# EAGLE design Qwiic_AS3935_Lightning_Detector (EAGLE 9.2.1)
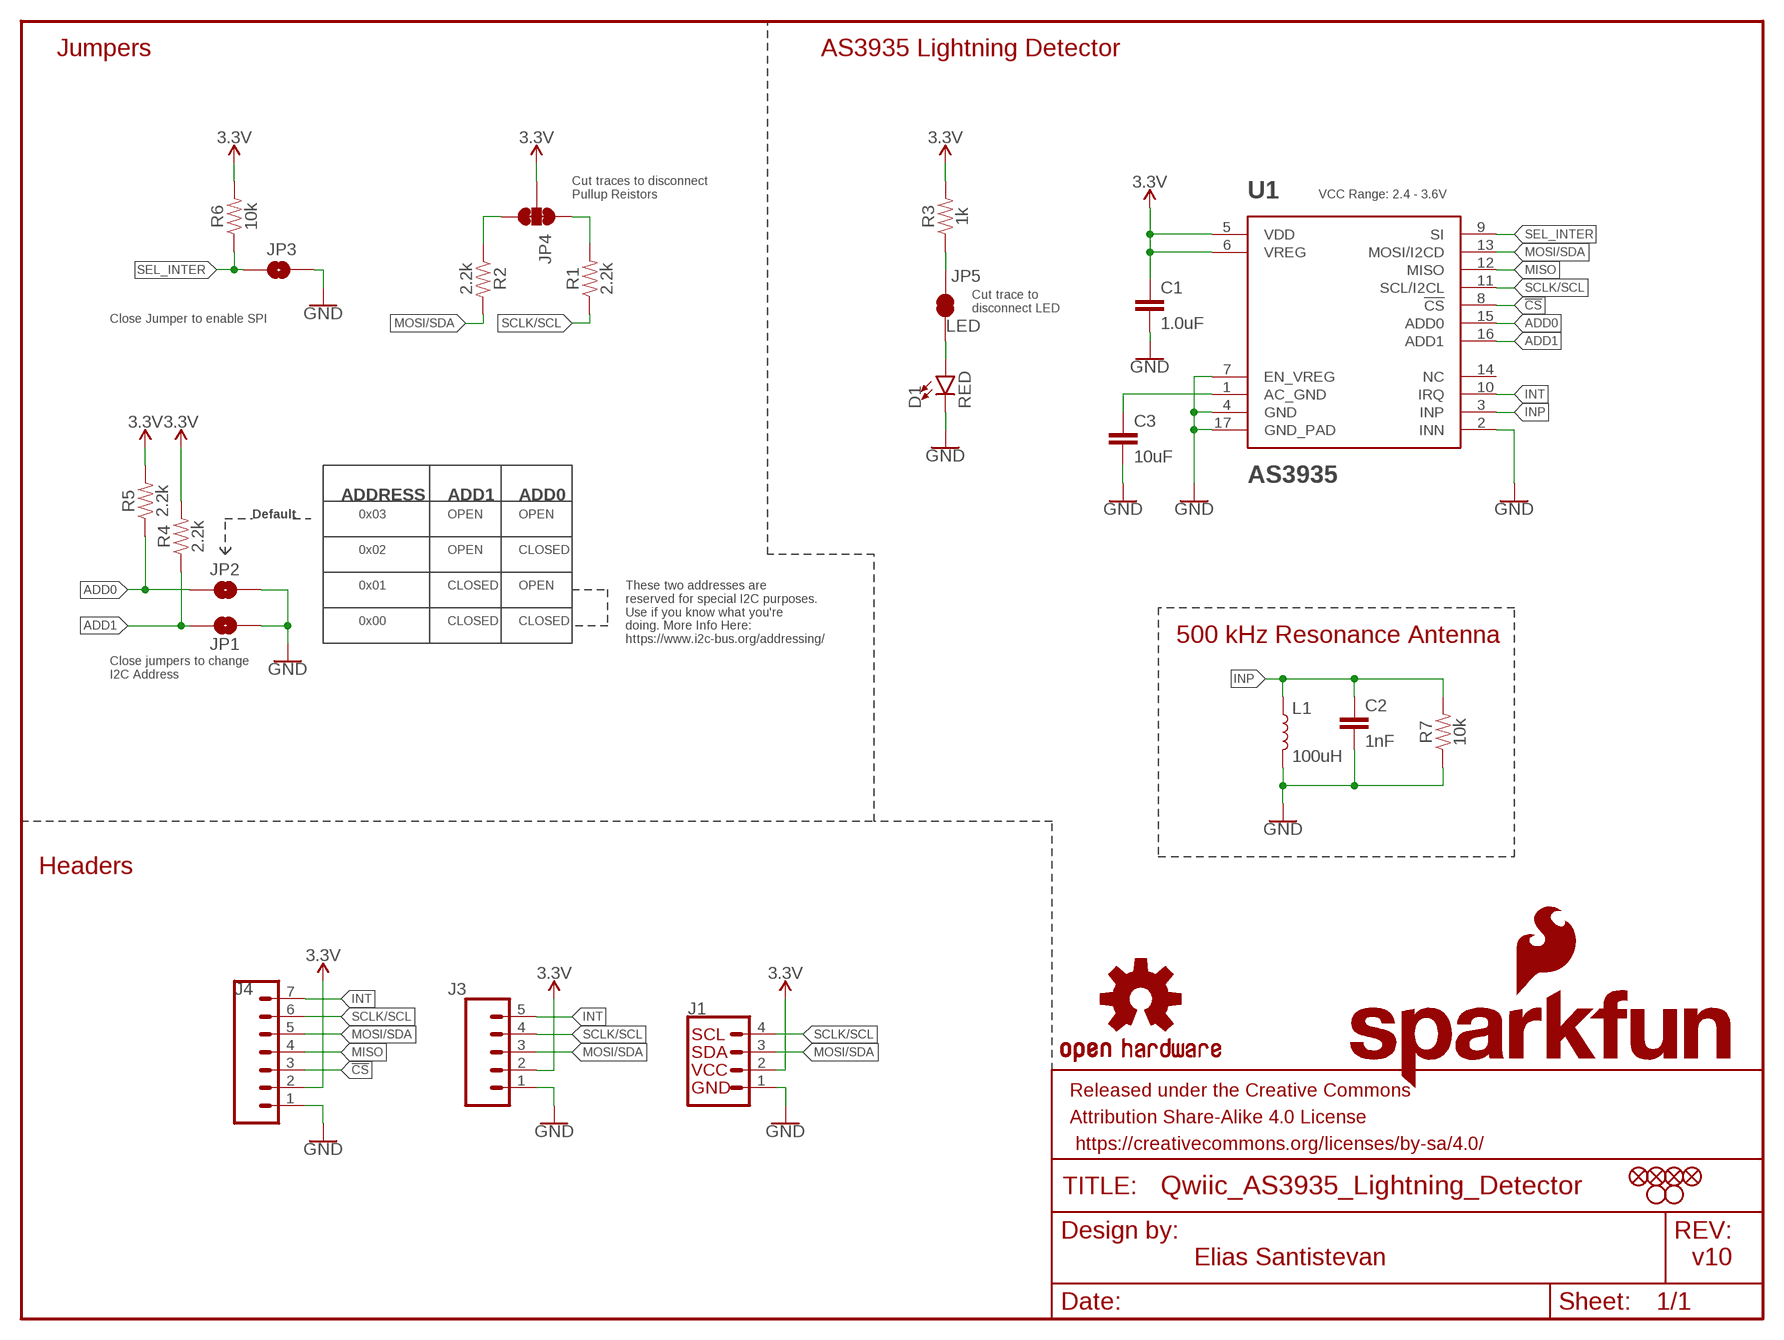
[diagram p0: schematic, sheet 1]

## Parts
C1  1.0uF  1.0UF-0603-16V-10%  [0603]
C2  1nF  1.0NF/1000PF-0603-50V-10%  [0603]
C3  10uF  10UF-0603-6.3V-20%  [0603]
D1  RED  LED-RED0603  [LED-0603]
FD1  FIDUCIAL1X2  [FIDUCIAL-1X2]
FD2  FIDUCIAL1X2  [FIDUCIAL-1X2]
FD3  FIDUCIAL1X2  [FIDUCIAL-1X2]
FD4  FIDUCIAL1X2  [FIDUCIAL-1X2]
FRAME1  FRAME-LETTER  [CREATIVE_COMMONS]
H1  STAND-OFFTIGHT  [STAND-OFF-TIGHT]
H2  STAND-OFFTIGHT  [STAND-OFF-TIGHT]
J1  QWIIC_CONNECTORJS-1MM  [JST04_1MM_RA]
J3  CONN_05NO_SILK  [1X05_NO_SILK]
J4  CONN_07NO_SILK  [1X07_NO_SILK]
JP1  JUMPER-SMT_2_NO_SILK  [SMT-JUMPER_2_NO_SILK]
JP2  JUMPER-SMT_2_NO_SILK  [SMT-JUMPER_2_NO_SILK]
JP3  JUMPER-SMT_2_NO_SILK  [SMT-JUMPER_2_NO_SILK]
JP4  JUMPER-SMT_3_2-NC_TRACE_SILK  [SMT-JUMPER_3_2-NC_TRACE_SILK]
JP5  LED  JUMPER-SMT_2_NC_TRACE_SILK  [SMT-JUMPER_2_NC_TRACE_SILK]
L1  100uH  MA5532-AE  [MA5532-AE]
LOGO1  OSHW-LOGOS  [OSHW-LOGO-S]
LOGO2  SFE_LOGO_NAME.1_INCH  [SFE_LOGO_NAME_.1]
LOGO3  SFE_LOGO_FLAME.1_INCH  [SFE_LOGO_FLAME_.1]
R1  2.2k  2.2KOHM-0603-1/10W-1%  [0603]
R2  2.2k  2.2KOHM-0603-1/10W-1%  [0603]
R3  1k  1KOHM-0603-1/10W-1%  [0603]
R4  2.2k  2.2KOHM-0603-1/10W-1%  [0603]
R5  2.2k  2.2KOHM-0603-1/10W-1%  [0603]
R6  10k  10KOHM-0603-1/10W-1%  [0603]
R7  10k  10KOHM-0603-1/10W-1%  [0603]
U1  AS3935  AS3935QFN  [16LD_MLPQ]

## Nets
3.3V: C1.1 J1.2 J3.2 J4.2 JP4.2 R3.2 R4.2 R5.2 R6.2 U1.5(VDD) U1.6(VREG)
!CS: J4.3 U1.8(!CS)
ADD0: JP2.1 R5.1 U1.15(ADD0)
ADD1: JP1.1 R4.1 U1.16(ADD1)
GND: C1.2 C2.2 C3.2 D1.C J1.1 J3.1 J4.1 JP1.2 JP2.2 JP3.2 L1.2 R7.1 U1.2(INN) U1.4(GND) U1.7(EN_VREG) U1.17(GND_PAD)
INP: C2.1 L1.1 R7.2 U1.3(INP)
INT: J3.5 J4.7 U1.10(IRQ)
MISO: J4.4 U1.12(MISO)
MOSI/SDA: J1.3 J3.3 J4.5 R2.2 U1.13(MOSI/I2CD)
N$1: JP5.2 R3.1
N$2: C3.1 U1.1(AC_GND)
N$3: JP4.1 R1.2
N$4: JP4.3 R2.1
N$5: D1.A JP5.1
SCLK/SCL: J1.4 J3.4 J4.6 R1.1 U1.11(SCL/I2CL)
SEL_INTER: JP3.1 R6.1 U1.9(SI)
Unconnected: U1.14(NC)

## Notes on the sheet
- Jumpers | AS3935 Lightning Detector
- Cut traces to disconnect
  Pullup Reistors
- VCC Range: 2.4 - 3.6V
- Cut trace to 
  disconnect LED
- Close Jumper to enable SPI
- ADDRESS | ADD1 | ADD0
- Default | 0x03 | OPEN | OPEN
- 0x02 | OPEN | CLOSED
- 0x01 | CLOSED | OPEN
- 0x00 | CLOSED | CLOSED
- These two addresses are
  reserved for special I2C purposes. 
  Use if you know what you're 
  doing. More Info Here:
  https://www.i2c-bus.org/addressing/
- 500 kHz Resonance Antenna
- Close jumpers to change 
  I2C Address
- Headers
- Elias Santistevan | v10

## Library data of the parts
C1 = SparkFun-Capacitors:1.0UF: 1µF ceramic capacitors A capacitor is a passive two-terminal electrical component used to store electrical energy temporarily in an electric field.; PROD_ID: CAP-00868
C2 = SparkFun-Capacitors:1.0NF/1000PF: 1nF/1,000pF ceramic capacitors A capacitor is a passive two-terminal electrical component used to store electrical energy temporarily in an electric field.; PROD_ID: CAP-07886
C3 = SparkFun-Capacitors:10UF: 10.0µF ceramic capacitors A capacitor is a passive two-terminal electrical component used to store electrical energy temporarily in an electric field.; PROD_ID: CAP-11015
D1 = SparkFun-LED:LED-RED: Red SMD LED Used in manufacturing of most products at SparkFun Packages: 0603 - SMD 0603 package [Product Link] <http://docs.avagotech.com/docs/AV02-0551EN> 0603 SMART - SMD 0603 SMART package ( more efficient and expensive)[Product Link] <http://www.osram-os.com/Graphics/XPic2/00077099_0.pdf> 1206 - SMD1206 package [Product Link] <https://www.sparkfun.com/datasheets/DevTools/LilyPad/Q150OVS4.pdff> SparkFun Products: Pro Mini 328 -5V <https://www.sparkfun.com/products/821> RedBoard <https://www.sparkfun.com/products/12757> IOIO-OTG <https://www.sparkfun.com/products/13613>; PROD_ID: DIO-00819
FD1-FD4 = SparkFun-Aesthetics:FIDUCIAL: Fiducial Alignment Points Point-of-reference for pick-and-place machines and other optical instruments.
FRAME1 = SparkFun-Aesthetics:FRAME-LETTER: Schematic Frame - Letter Standard 8.5x11 US Letter frame
H1 H2 = SparkFun-Hardware:STAND-OFF: Stand Off Drill holes for mechanically mounting via screws, standoffs, etc. Note: Use the keepout ring to avoid running the screw head into surrounding components. Variant Overviews STAND-OFF - Mechanical footprint for a #4 phillips button head screw. STAND-OFF-TIGHT - Mechanical footprint for a #4 phillips button head screw, Example SparkFun Products Screw - Phillips Head (1/4", 4-40, 10 pack) <https://www.sparkfun.com/products/10453> (PRT-10453) Screw - Phillips Head (1/2", 4-40, 10 pack) <https://www.sparkfun.com/products/10452> (PRT-10452) Screw - Phillips Head (3/4", 4-40, 10 pack) <https://www.sparkfun.com/products/10451> (PRT-10451) Screw - Phillips Head (1", 4-40, 10 pack) <https://www.sparkfun.com/products/10450> (PRT-10450)
J1 = SparkFun-Connectors:QWIIC_CONNECTOR: SparkFun I2C Standard Qwiic Connector An SMD 1mm pitch JST connector makes it easy and quick (get it? Qwiic?) to connect I2C devices to each other. The Qwiic system <http://www.sparkfun.com/qwiic> enables fast and solderless connection between popular platforms and various sensors and actuators. We carry 200mm <https://www.sparkfun.com/products/14204>, 100mm <https://www.sparkfun.com/products/14205>, 50mm <https://www.sparkfun.com/products/14206>, and breadboard friendly <https://www.sparkfun.com/products/14207> Qwiic cables. We also offer 10 pcs strips <https://www.sparkfun.com/products/14323> the SMD connectors.; PROD_ID: CONN-13694
J3 = SparkFun-Connectors:CONN_05: Multi connection point. Often used as Generic Header-pin footprint for 0.1 inch spaced/style header connections On any of the 0.1 inch spaced packages, you can populate with these: Break Away Headers - Straight <https://www.sparkfun.com/products/116> (PRT-00116) Break Away Male Headers - Right Angle <https://www.sparkfun.com/products/553> (PRT-00553) Female Headers <https://www.sparkfun.com/products/115> (PRT-00115) Break Away Headers - Machine Pin <https://www.sparkfun.com/products/117> (PRT-00117) Break Away Female Headers - Swiss Machine Pin <https://www.sparkfun.com/products/743> (PRT-00743) For SCREWTERMINALS and SPRING TERMINALS visit here: Screw Terimnals on SparkFun.com <https://www.sparkfun.com/search/results?term=Screw+Terminals> (5mm/3.5mm/2.54mm spacing) This device is also useful as a general connection point to wire up your design to another part of your project. Our various solder wires solder well into these plated through hole pads. Hook-Up Wire - Assortment (Stranded, 22 AWG) <https://www.sparkfun.com/products/11375> (PRT-11375) Hook-Up Wire - Assortment (Solid Core, 22 AWG) <https://www.sparkfun.com/products/11367> (PRT-11367) View the entire wire category on our website here <https://www.sparkfun.com/categories/141> Special notes: Molex polarized connector foot print use with SKU : PRT-08231 with associated crimp pins and housings. 1MM SMD Version SKU: PRT-10208
J4 = SparkFun-Connectors:CONN_07: Multi connection point. Often used as Generic Header-pin footprint for 0.1 inch spaced/style header connections On any of the 0.1 inch spaced packages, you can populate with these: Break Away Headers - Straight <https://www.sparkfun.com/products/116> (PRT-00116) Break Away Male Headers - Right Angle <https://www.sparkfun.com/products/553> (PRT-00553) Female Headers <https://www.sparkfun.com/products/115> (PRT-00115) Break Away Headers - Machine Pin <https://www.sparkfun.com/products/117> (PRT-00117) Break Away Female Headers - Swiss Machine Pin <https://www.sparkfun.com/products/743> (PRT-00743) For SCREWTERMINALS and SPRING TERMINALS visit here: Screw Terimnals on SparkFun.com <https://www.sparkfun.com/search/results?term=Screw+Terminals> (5mm/3.5mm/2.54mm spacing) This device is also useful as a general connection point to wire up your design to another part of your project. Our various solder wires solder well into these plated through hole pads. Hook-Up Wire - Assortment (Stranded, 22 AWG) <https://www.sparkfun.com/products/11375> (PRT-11375) Hook-Up Wire - Assortment (Solid Core, 22 AWG) <https://www.sparkfun.com/products/11367> (PRT-11367) View the entire wire category on our website here <https://www.sparkfun.com/categories/141> Special notes: Molex polarized connector foot print use with SKU : PRT-08231 with associated crimp pins and housings. 1MM SMD Version SKU: PRT-10208 NOTES ON THE VARIANTS LOCK and LOCK_LONGPADS... This footprint was designed to help hold the alignment of a through-hole component (i.e. 6-pin header) while soldering it into place. You may notice that each hole has been shifted either up or down by 0.005 of an inch from it's more standard position (which is a perfectly straight line). This slight alteration caused the pins (the squares in the middle) to touch the edges of the holes. Because they are alternating, it causes a "brace" to hold the component in place. 0.005 has proven to be the perfect amount of "off-center" position when using our standard breakaway headers. Although looks a little odd when you look at the bare footprint, once you have a header in there, the alteration is very hard to notice. Also,if you push a header all the way into place, it is covered up entirely on the bottom side.
JP1-JP3 = SparkFun-Jumpers:JUMPER-SMT_2_NO: Normally open jumper This jumper has two pads in close proximity to each other. Apply solder to close the connection. Round pads are easier to solder for beginners, but are a lot larger. SparkFun Product that uses the round pads: SparkFun EL Sequencer <https://www.sparkfun.com/products/12781>
JP4 = SparkFun-Jumpers:JUMPER-SMT_3_2-NC_TRACE: Normally closed trace jumper (2 of 2 connections) This jumper has a trace between all three pads so they are normally closed (NC). Use a razor knife to open the connection(s). For best results follow the IPC guidelines for cutting traces: Cutout at least 0.063 mm (0.005 in). Remove all loose material to clean up the cut area. Seal the cut with an approved epoxy. Reapply solder to reclose the connection(s).
JP5 = SparkFun-Jumpers:JUMPER-SMT_2_NC_TRACE: Normally closed trace jumper This jumper has a trace between two pads so it's normally closed (NC). Use a razor knife to open the connection. For best results follow the IPC guidelines for cutting traces: Cutout at least 0.063 mm (0.005 in). Remove all loose material to clean up the cut area. Seal the cut with an approved epoxy. Reapply solder to reclose the connection.
L1 = SparkFun-Coils:MA5532-AE: RFID Transponder Coil - MA5532-AE; PROD_ID: NDUC-11334
LOGO1 = SparkFun-Aesthetics:OSHW-LOGO: Open-Source Hardware (OSHW) Logo This logo indicates the piece of hardware it is found on incorporates a OSHW license and/or adheres to the definition of open source hardware found here: http://freedomdefined.org/OSHW
LOGO2 = SparkFun-Aesthetics:SFE_LOGO_NAME: SparkFun Font Logo This is the SparkFun name logo. The logo on the schematic will always be the same size; the package variant is the height of the flame part of the logo (or the height the flame would be, if it were drawn). Default layer for the logo on the board is tSilk.
LOGO3 = SparkFun-Aesthetics:SFE_LOGO_FLAME: SparkFun Flame Logo This is the SparkFun flame logo. The logo on the schematic will always be the same size; the package variant is the height of the flame. Default layer for the logo on the board is tSilk.
R1 R2 R4 R5 = SparkFun-Resistors:2.2KOHM: 2.2kΩ resistor A resistor is a passive two-terminal electrical component that implements electrical resistance as a circuit element. Resistors act to reduce current flow, and, at the same time, act to lower voltage levels within circuits. - Wikipedia; PROD_ID: RES-08272
R3 = SparkFun-Resistors:1KOHM: 1kΩ resistor A resistor is a passive two-terminal electrical component that implements electrical resistance as a circuit element. Resistors act to reduce current flow, and, at the same time, act to lower voltage levels within circuits. - Wikipedia; PROD_ID: RES-07856
R6 R7 = SparkFun-Resistors:10KOHM: 10kΩ resistor A resistor is a passive two-terminal electrical component that implements electrical resistance as a circuit element. Resistors act to reduce current flow, and, at the same time, act to lower voltage levels within circuits. - Wikipedia; PROD_ID: RES-00824
U1 = SparkFun-Sensors:AS3935: AS3935 Franklin Lightning Sensor The AS3935 is a programmable fully integrated Lightning Sensor IC that detects the presence and approach of potentially hazardous lightning activity in the vicinity and provides an estimation on the distance to the head of the storm. The embedded lightning algorithm checks the incoming signal pattern to reject the potential man-made disturbers.The AS3935 can also provide information on the noise level and inform the external unit (e.g. microcontroller) in case of high noise conditions, with the noise floor generator and noise floor evaluation blocks.; PROD_ID: IC-11333

## Board
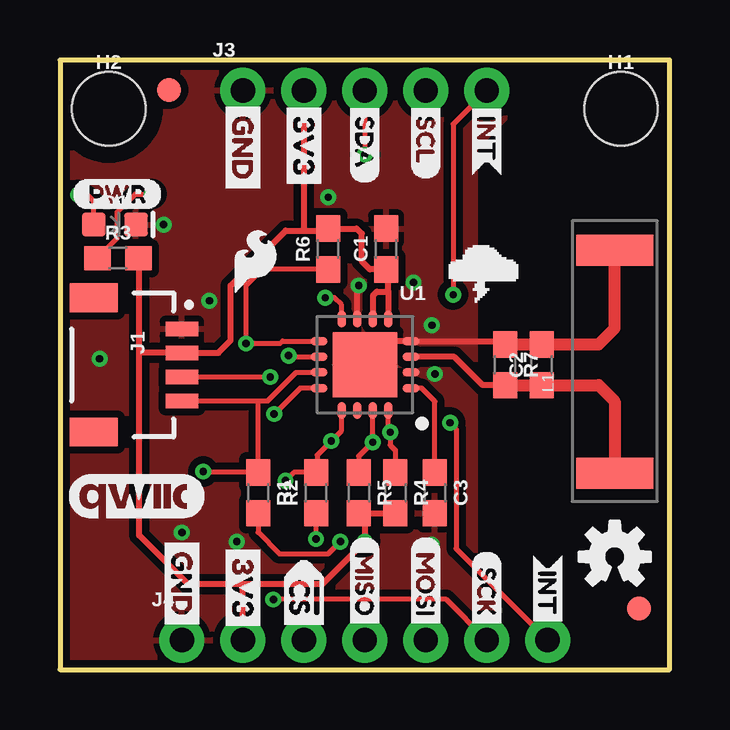
[diagram p1: board, top side]
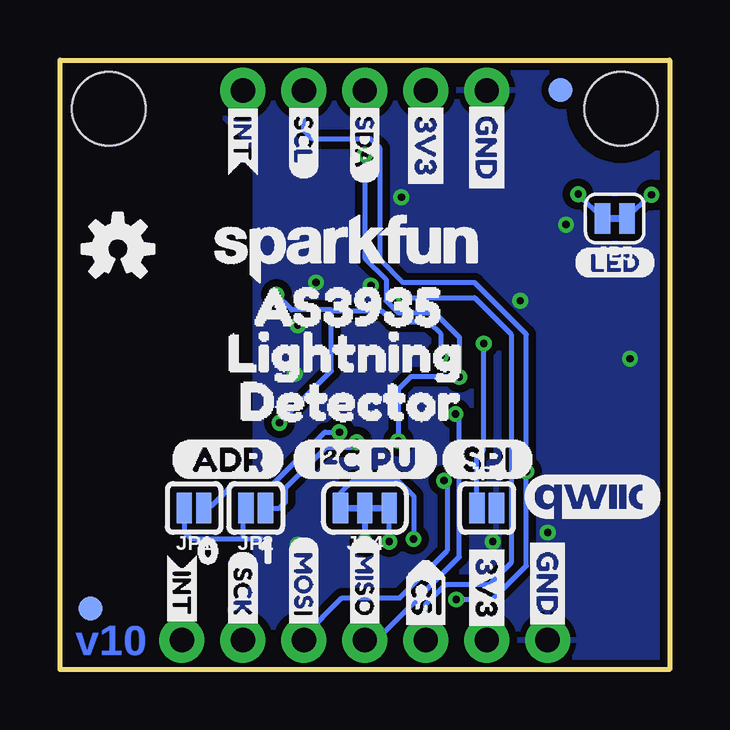
[diagram p2: board, bottom side, seen from below]

Size 25.4 x 25.4 mm. Coordinates in mm from the lower left corner, seen from the top.
Outline: 0,0 25.4,0 25.4,25.4 0,25.4 0,0
Copper layers (1*16): Top 0.035mm / dielectric 1.5mm / Bottom 0.035mm
Design rules "SparkFun-2-layer-TIGHT": minimum track width 7mil, minimum drill 15mil, track to track 7mil, track to pad 7mil, pad to pad 7mil, via to via 7mil, smd to smd 7mil, copper to edge 7mil, drill to drill 7mil, minimum pad ring 7mil, minimum via ring 7mil, stop-mask expansion 4mil, vias tented up to drill 25mil, thermal gap 10mil

### Footprints (pad centres in the part's own frame; a part is rotated, then mirrored left to right if it is on the bottom)
0603 = smd 1.1 x 1: 1 -0.85,0; 2 0.85,0
LED-0603 = smd 1 x 1: A -0.877,0; C 0.877,0
FIDUCIAL-1X2 = smd 1 x 1: 1 0,0
STAND-OFF-TIGHT = hole 3.048: 0,0
JST04_1MM_RA = smd 0.6 x 1.35: 1 -1.5,0; 2 -0.5,0; 3 0.5,0; 4 1.5,0 | smd 1.2 x 2: NC1 2.8,-3.675; NC2 -2.8,-3.675
1X05_NO_SILK = drill 1.016 pad 1.88: 1 0,0; 2 2.54,0; 3 5.08,0; 4 7.62,0; 5 10.16,0
1X07_NO_SILK = drill 1.016 pad 1.88: 1 0,0; 2 2.54,0; 3 5.08,0; 4 7.62,0; 5 10.16,0; 6 12.7,0; 7 15.24,0
SMT-JUMPER_2_NO_SILK = smd 0.635 x 1.27: 1 -0.406,0; 2 0.406,0
SMT-JUMPER_3_2-NC_TRACE_SILK = smd 0.635 x 1.27: 1 -1.016,0; 2 0,0; 3 1.016,0
SMT-JUMPER_2_NC_TRACE_SILK = smd 0.635 x 1.27: 1 -0.508,0; 2 0.508,0
MA5532-AE = smd 1.3 x 3.2: 1 -4.65,0; 2 4.65,0
16LD_MLPQ = smd 0.7 x 0.35: 1 -1.919,0.968; 2 -1.919,0.318; 3 -1.919,-0.332; 4 -1.919,-0.982; 9 1.908,-0.982; 10 1.908,-0.332; 11 1.908,0.318; 12 1.908,0.968 | smd 0.35 x 0.7: 5 -0.982,-1.917; 6 -0.332,-1.917; 7 0.318,-1.917; 8 0.968,-1.917; 13 0.968,1.907; 14 0.318,1.907; 15 -0.332,1.907; 16 -0.982,1.907 | smd 2.7 x 2.7: 17 -0.007,-0.007

### Placement (x,y rotation side)
C1  13.59,17.53 90 top
C2  20.07,12.7 90 top
C3  15.62,7.37 270 top
D1  2.29,18.54 0 top
FD1  4.54,24.16 0 bottom
FD2  24.13,2.54 0 bottom
FD3  24.13,2.54 0 top
FD4  4.55,24.16 0 top
FRAME1  -7.62,-19.05 0 top  (outside the outline)
H1  23.37,23.37 0 top
H2  2.03,23.37 0 top
J1  5.08,12.7 270 top
J3  7.62,24.13 0 top
J4  5.08,1.23 0 top
JP1  19.81,6.73 180 bottom
JP2  17.25,6.73 180 bottom
JP3  7.62,6.73 0 bottom
JP4  12.7,6.73 180 bottom
JP5  2.29,18.8 180 bottom
L1  23.11,12.83 90 top
LOGO1  23.11,4.7 0 top
LOGO2  13.46,17.53 0 bottom
LOGO3  8.13,17.02 0 top
R1  8.26,7.37 270 top
R2  10.67,7.37 90 top
R3  2.41,17.14 0 top
R4  13.97,7.37 270 top
R5  12.45,7.37 270 top
R6  11.18,17.53 90 top
R7  18.54,12.7 270 top
U1  12.7,12.7 180 top
U$1  [LED0]  4,16.96 0 bottom
U$3  [QWIIC_COPYRIGHT_SMALL]  3.17,7.24 0 top
U$4  [QWIIC_COPYRIGHT_SMALL]  3.23,7.22 0 bottom
U$6  [AS39350]  18.67,15.11 0 bottom
U$7  [LIGHTNING0]  19.81,13.21 0 bottom
U$8  [GND-03]  7.62,23.88 270 top
U$9  [GND-03]  5.08,5.71 270 top
U$10  [GND-03]  5.08,5.71 270 bottom
U$11  [CS#-<]-04]  10.16,4.83 270 top
U$12  [MISO-(]-03]  12.7,5.59 270 bottom
U$13  [MISO-(]-03]  12.7,5.59 270 top
U$14  [INT0]  20.32,4.83 270 bottom
U$15  [INT0]  17.78,23.75 270 bottom
U$16  [MOSI-(]-03]  15.24,5.59 270 top
U$17  [3V3-03]  7.62,5.46 270 top
U$18  [3V3-03]  7.62,5.46 270 bottom
U$19  [SCK-(]-03]  17.78,4.95 270 top
U$20  [3V3-03]  10.16,23.88 270 bottom
U$21  [3V3-03]  10.16,23.88 270 top
U$22  [MOSI-(]-03]  15.24,5.59 270 bottom
U$23  [SCK-(]-03]  17.78,4.95 270 bottom
U$24  [INT0]  17.78,23.75 270 top
U$25  [SDA0]  12.7,23.75 270 top
U$26  [SDA0]  12.7,23.75 270 bottom
U$27  [SCL0]  15.24,23.75 270 bottom
U$28  [SCL0]  15.24,23.75 270 top
U$29  [INT0]  20.32,4.83 270 top
U$30  [#CS0]  10.16,4.83 270 bottom
U$31  [OSHW-LOGO-S]  22.99,17.53 0 bottom
U$32  [PWR-()-03]  0.51,19.81 0 top
U$33  [ADR-()-04]  20.83,8.76 0 bottom
U$34  [I#C_PU0]  15.75,8.76 0 bottom
U$35  [SPI0]  9.53,8.76 0 bottom
U$36  [10]  18.03,4.95 0 bottom
U$37  [00]  20.57,4.95 0 bottom
U$38  [GND-03]  7.62,23.88 270 bottom
U$39  [DETECTOR0]  19.3,11.18 0 bottom
U$40  [##0]  13.59,16.64 0 top

### Tracks (layer width: path | path; a pad name or v marks a point on that pad's centre or on a via)
3.3V  (via drill 0.3)
  Top 0.254: R4.2 R5.2 12.7,6.26 v12.7,5.33 10.92,3.56 7.62,3.56 | 13.68,15.75 13.68,16.58 C1.1 12.91,16.68 12.57,17.02 12.57,18.16 12.36,18.38 R6.2 11.09,18.29 10.16,18.29 | 10.16,18.29 9.4,18.29 7.11,16 7.11,13.72 6.6,13.2 J1.2 3.31,13.2 3.3,13.21 | J3.2 10.16,18.29 | 13.68,15.75 13.21,15.75 13.03,15.57 U1.6 | J4.2 7.62,3.56 | R3.2 3.3,17.11 3.3,13.21 | 3.3,13.21 3.3,5.59 5.33,3.56 7.62,3.56 | 13.68,15.75 U1.5
  Bottom 0.254: JP4.2 v12.7,5.33
!CS  (via drill 0.3)
  Top 0.203: v11.05,15.49 11.43,15.49 11.73,15.19 U1.8
  Bottom 0.203: v11.05,15.49 8.13,15.49 6.6,13.97 6.6,4.45 7.49,3.56 9.34,3.56 10.16,2.73 J4.3
ADD0  (via drill 0.3)
  Top 0.203: R5.1 12.45,8.89 v13.03,9.48 U1.15
  Bottom 0.203: JP2.1 16.26,6.73 16,6.99 16,7.57 14.3,9.27 13.24,9.27 v13.03,9.48
ADD1  (via drill 0.3)
  Top 0.203: R4.1 13.97,9.14 13.76,9.35 v13.76,9.89 13.68,9.97 U1.16
  Bottom 0.203: v13.76,9.89 14.37,9.89 16.51,7.75 18.16,7.75 19.08,6.83 19.31,6.83 JP1.1
GND  (via drill 0.3)
  Top 0.254: R7.1 18.41,13.68 U1.4 12.86,13.68 12.38,13.21 12.38,13.03 U1.17 | U1.7 12.38,15.94 v12.45,16
  Top 0.508: R7.1 C2.2 22.44,13.55 23.11,14.22 L1.2
  Bottom 0.203: JP1.2 20.22,5.74 19.94,5.46 17.78,5.46 | 17.78,5.46 17.02,5.46 | JP2.2 17.78,6.6 17.78,5.46
  other vias: 7.37,5.33 6.22,15.37 4.32,18.54 14.73,16.13 5.08,5.71 15.49,5.21 1.65,12.95 11.18,19.68 15.62,12.32 15.49,14.35
  pour Top (isolate 0.305): 20.83,0 0,0 0,25.4 20.95,25.4 17.27,21.72 17.27,3.56
  pour Bottom (isolate 0.305): 0,25.4 20.95,25.4 17.27,21.72 17.27,3.56 20.83,0 0,0
INP
  Top 0.254: 18.8,11.85 17.61,11.85 16.43,13.03 U1.3
  Top 0.508: R7.2 18.8,11.85 C2.1 22.44,11.85 23.11,11.18 L1.1
INT  (via drill 0.3)
  Top 0.203: J4.7 16.51,5.04 16.51,10.03 v16.26,10.29 | J3.5 16.38,22.73 v16.38,15.62 | v9.53,13.08 9.57,13.03 U1.10
  Bottom 0.203: v9.53,13.08 9.53,13.97 10.03,14.48 11.52,14.48 11.98,14.94 14.1,14.94 | v16.26,10.29 14.1,12.45 14.1,14.94 | 14.1,14.94 14.1,14.99 15.75,14.99 v16.38,15.62
MISO  (via drill 0.3)
  Top 0.203: U1.12 10,11.73 v8.92,10.65
  Bottom 0.203: v8.92,10.65 8.76,10.49 8.76,4.7 12.23,1.23 J4.4
MOSI/SDA  (via drill 0.3)
  Top 0.203: J3.3 v12.7,21.46 | J1.3 v8.76,12.2 v8.76,12.19 | v9.4,7.87 9.74,8.22 R2.2 10.72,8.26 10.72,8.94 v11.3,9.53 11.73,9.95 U1.13
  Bottom 0.203: J4.5 15.24,1.4 13.65,2.98 11.24,2.98 9.27,4.95 9.27,7.75 v9.4,7.87 | v12.7,21.46 12.7,17.14 11.81,16.26 11.81,15.37 11.3,14.86 9.78,14.86 8.76,13.84 v8.76,12.19 10.79,12.19 11.3,11.68 v11.3,9.53
N$1  (via drill 0.3)
  Top 0.203: v3.81,19.81 3.13,19.81 2.38,19.07 2.38,17.97 R3.1
  Bottom 0.203: v3.81,19.81 JP5.2
N$2
  Top 0.203: C3.1 15.62,11.18 15.06,11.73 U1.1
N$3  (via drill 0.3)
  Top 0.203: R1.2 8.26,5.71 9.14,4.83 11.18,4.83 v11.68,5.33
  Bottom 0.203: v11.68,5.33 JP4.1
N$4  (via drill 0.3)
  Top 0.203: v10.67,5.44 R2.1
  Bottom 0.203: JP4.3 13.72,7.37 13.14,7.94 11.37,7.94 10.67,7.24 v10.67,5.44
N$5  (via drill 0.3)
  Top 0.203: D1.A 1.41,19.51 1.14,19.78 v0.76,19.78
  Bottom 0.203: v0.76,19.78 0.79,19.78 JP5.1
SCLK/SCL  (via drill 0.3)
  Top 0.203: J1.4 8.26,11.2 | 8.26,11.2 8.66,11.2 9.84,12.38 U1.11 | 8.26,11.2 R1.1 6.01,8.22 v5.97,8.26 | J4.6 16.09,2.92 v8.89,2.92
  Bottom 0.203: v8.89,2.92 7.37,2.92 5.97,4.32 v5.97,8.26 5.97,13.97 8.13,16.13 11.1,16.13 12.06,17.09 12.06,21.72 12.45,22.1 14.86,22.1 15.24,22.48 J3.4
SEL_INTER  (via drill 0.3)
  Top 0.203: R6.1 8.42,16.68 7.75,16 v7.75,13.59 9.17,13.59 9.27,13.69 10.78,13.69 U1.9
  Bottom 0.203: v7.75,13.59 7.75,9.14 8.03,8.87 JP3.1

### Text on the board
Bottom: v10
Measures: Units in Inches
tDocu: Elias Santistevan